# Altium schematic sheet Autoreset.SchDoc
size A4; SheetNumber: 6; SheetTotal: 7
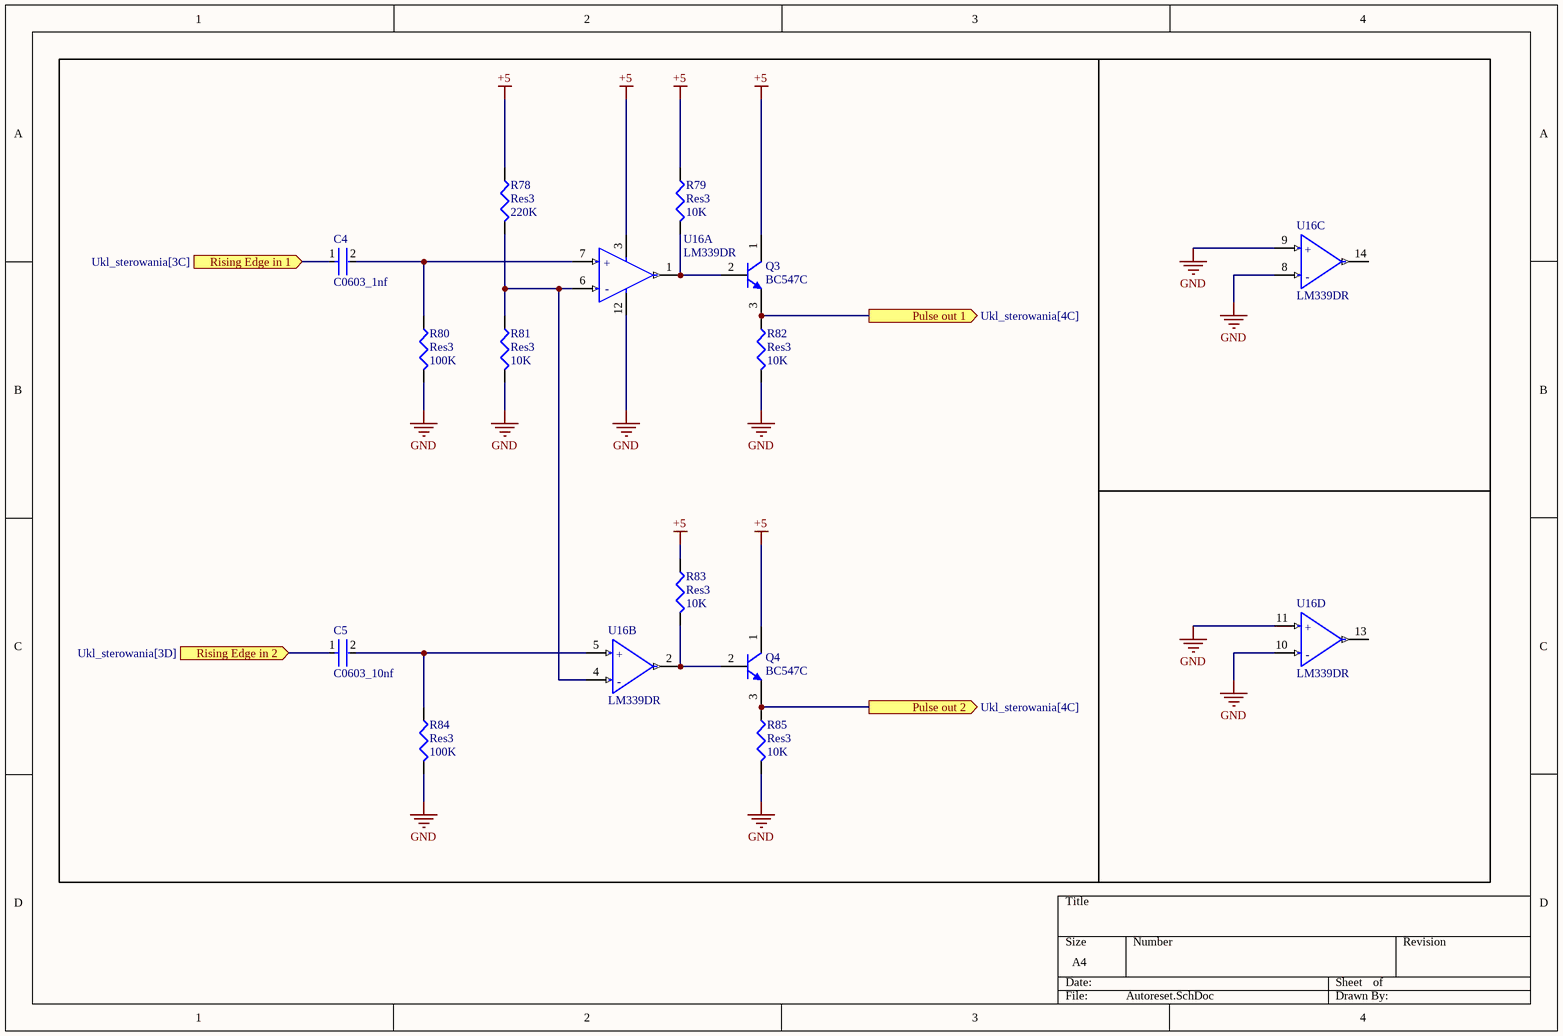
[diagram p0: Autoreset.SchDoc]

## Parts
C4  C0603_1nf  [FP-C0603C-CF-MFG]
C5  C0603_10nf  [FP-C0603C-CF-MFG]
Q3  BC547C  [ONSC-TO-92-3-29-11]
Q4  BC547C  [ONSC-TO-92-3-29-11]
R78  Res3  value 220K  [J1-0603]
R79  Res3  value 10K  [J1-0603]
R80  Res3  value 100K  [J1-0603]
R81  Res3  value 10K  [J1-0603]
R82  Res3  value 10K  [J1-0603]
R83  Res3  value 10K  [J1-0603]
R84  Res3  value 100K  [J1-0603]
R85  Res3  value 10K  [J1-0603]
U16  LM339DR  [FP-D0014A-MFG]  (parts A,B,C,D of 4)

## Ports
Pulse out 1 (out, see Ukl_sterowania[4C]), Pulse out 2 (out, see Ukl_sterowania[4C]), Rising Edge in 1 (in, see Ukl_sterowania[3C]), Rising Edge in 2 (in, see Ukl_sterowania[3D])

## Nets
+5: Q3.1(C) Q4.1(C) R78.1 R79.1 R83.1 U16.3(VCC)
GND: R80.2 R81.2 R82.2 R84.2 R85.2 U16.8(3IN-) U16.9(3IN+) U16.10(4IN-) U16.11(4IN+) U16.12(GND)
Pulse out 1: Q3.3(E) R82.1 ; port Pulse out 1
Pulse out 2: Q4.3(E) R85.1 ; port Pulse out 2
Rising Edge in 1: C4.1 ; port Rising Edge in 1
Rising Edge in 2: C5.1 ; port Rising Edge in 2
NetC4_2: C4.2 R80.1 U16.7(1IN+)
NetC5_2: C5.2 R84.1 U16.5(2IN+)
NetQ3_2: Q3.2(B) R79.2 U16.1(1OUT)
NetQ4_2: Q4.2(B) R83.2 U16.2(2OUT)
NetR78_2: R78.2 R81.1 U16.4(2IN-) U16.6(1IN-)

Not connected (* = marked no-connect by the designer): U16 13(OUT4) 14(OUT3)

## Notes on the sheet
- (in symbol CMP-04896-000028-1, part A) +; -
- (in symbol CMP-04896-000028-1, part B) +; -
- (in symbol CMP-04896-000028-1, part C) +; -
- (in symbol CMP-04896-000028-1, part D) +; -

## Library data of the parts
C4 C5 = CMP-1035-00914-3: CAP CER 30PF 50V 5% NP0 0603; Manufacturer Part Number: C0603C300J5GACTU; Manufacturer: KEMET; Automotive Grade: Grade 1; Temperature Coefficient: 30ppm/°C; Material: Ceramic; Temperature Characteristic: C0G; Tolerance: 0.05; ComponentLink2URL: https://api.kemet.com/component-edge/download/datasheet/C0603C100J5GACAUTO.pdf; Automotive: Yes; Device Class L2: Capacitors; Device Class L1: Passive Components; Device Class L3: Ceramic Capacitors; RoHS: TRUE; Octopart: https://octopart.com/c0603c300j5gactu-kemet-199455; Lead Free: Yes; Value: 30 pF; Temperature Range High: +125°C; Category: Cap; Temperature: -55°C to +125°C; Package: C0603C-CF; Capacitance: 30 pF; Digikey Description: CAP CER 30PF 50V 5% NP0 0603; Height: 0.87mm; ComponentLink2Description: Datasheet; Temperature Range Low: -55°C; Mouser Description: Multilayer Ceramic Capacitors MLCC - SMD/SMT 50volts 30pF C0G 5%; Voltage Rating: 50 V
Q3 Q4 = CMP-1048-01437-1: Amplifier Transistor, NPN Silicon, 3-Pin TO-92, Bulk Box; Manufacturer: On Semiconductor; IC Continuous (A): 0.1; fT Min (MHz): 150; Mounting Technology: Through Hole; ComponentLink1URL: http://www.onsemi.com/; ComponentLink1Description: Manufacturer URL; ComponentLink3URL: http://www.onsemi.cn/pub_link/Collateral/2N6426-D.PDF; DatasheetVersion: Rev. 7; PackageVersion: Rev. AM; Packing: Bulk Box; RoHS: FALSE; Polarity: NPN; PartNumber: BC547C; ComponentLink2URL: http://www.onsemi.com/pub_link/Collateral/BC546-D.PDF; ComponentLink3Description: Package Specification; PackageDescription: 3-Pin Transistor Outline, Body 4.825 x 3.685 mm, Pitch 1.27 mm; PackageReference: TO-92-3-29-11_AM_SL; ComponentLink2Description: Datasheet
R78-R85 = Res3: Resistor; Published: 8-Jun-2000; LatestRevisionDate: 29-May-2009; LatestRevisionNote: IPC-7351 Footprint Added.; PackageReference: J1-0603; Publisher: Altium Limited; PackageDescription: Chip Resistor
U16 = CMP-04896-000028-1: IC QUAD DIFF COMP 14-SOIC; Manufacturer: Texas Instruments; Nominal Supply Current: 0.8mA; Min Dual Supply Voltage: 1V; Number Of Channels: 4; Input Offset Voltage: 2mV; Max Junction Temp: +70°C; Min Supply Voltage: 2V; Response Time: 1.3us; Max Dual Supply Voltage: 18V; Max Supply Voltage: 30V; Standoff Height: 0.1mm; Input Bias Current: -0.025uA; Output Current Per Channel: 6mA; Category: IC; Octopart: https://octopart.com/lm339dr-texas+instruments-45532; Automotive: No; Temperature: 0°C to +70°C; Ipc Land Pattern Name: SOIC127P600X175-14; Temperature Range Low: 0°C; Mouser Description: Analog Comparators Quad Differential; Lead Free: Yes; Digikey Description: IC QUAD DIFF COMP 14-SOIC; ComponentLink2URL: http://www.ti.com/lit/ds/symlink/lm339.pdf; Device Class L3: Comparators; Manufacturer Part Number: LM339DR; Temperature Range High: +70°C; Device Class L2: Linear ICs; Height: 1.75mm; Device Class L1: Integrated Circuits (ICs); Package: D0014A; RoHS: TRUE; ComponentLink2Description: Datasheet